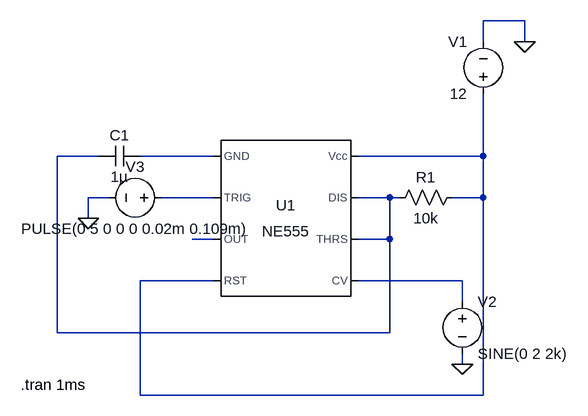
[diagram p0: schematic 18311a1930 PWM.asc]
18311a1930 PWM.asc, the LTspice schematic file:
Version 4
SHEET 1 880 680
WIRE 592 -128 528 -128
WIRE 528 -96 528 -128
WIRE 592 -96 592 -128
WIRE -64 80 -128 80
WIRE 112 80 0 80
WIRE 528 80 528 -16
WIRE 528 80 336 80
WIRE -48 144 -80 144
WIRE 112 144 32 144
WIRE 384 144 336 144
WIRE 400 144 384 144
WIRE 528 144 528 80
WIRE 528 144 480 144
WIRE -80 176 -80 144
WIRE 112 208 80 208
WIRE 384 208 384 144
WIRE 384 208 336 208
WIRE 112 272 0 272
WIRE 496 272 336 272
WIRE 496 304 496 272
WIRE -128 352 -128 80
WIRE 384 352 384 208
WIRE 384 352 -128 352
WIRE 496 400 496 384
WIRE 0 448 0 272
WIRE 528 448 528 144
WIRE 528 448 0 448
FLAG 592 -96 0
FLAG -80 176 0
FLAG 496 400 0
SYMBOL Misc\\NE555 224 176 R0
SYMATTR InstName U1
SYMBOL res 496 128 R90
WINDOW 0 0 56 VBottom 2
WINDOW 3 32 56 VTop 2
SYMATTR InstName R1
SYMATTR Value 10k
SYMBOL voltage 528 0 R180
WINDOW 0 24 96 Left 2
WINDOW 3 24 16 Left 2
WINDOW 123 0 0 Left 0
WINDOW 39 0 0 Left 0
SYMATTR InstName V1
SYMATTR Value 12
SYMBOL voltage 496 288 R0
WINDOW 123 0 0 Left 0
WINDOW 39 0 0 Left 0
SYMATTR InstName V2
SYMATTR Value SINE(0 2 2k)
SYMBOL voltage 48 144 R90
WINDOW 0 -32 56 VBottom 2
WINDOW 3 32 56 VTop 2
WINDOW 123 0 0 Left 0
WINDOW 39 0 0 Left 0
SYMATTR InstName V3
SYMATTR Value PULSE(0 5 0 0 0 0.02m 0.109m)
SYMBOL cap 0 64 R90
WINDOW 0 0 32 VBottom 2
WINDOW 3 32 32 VTop 2
SYMATTR InstName C1
SYMATTR Value 1µ
TEXT -184 432 Left 2 !.tran 1ms

The netlist it stands for:
* 18311a1930 PWM.asc
XU1 N002 N004 N005 N003 N006 N001 N001 N003 NE555  ; pins GND TRIG OUT RST CV THRS DIS Vcc
R1 N003 N001 10k
V1 N003 0 12
V2 N006 0 SINE(0 2 2k)
V3 N004 0 PULSE(0 5 0 0 0 0.02m 0.109m)
C1 N002 N001 1µ
.tran 1ms
.lib NE555.sub
.backanno
.end